# EAGLE schematic Peltier_Driver (EAGLE 7.1.0)
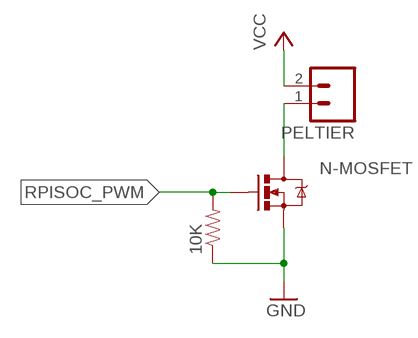
[diagram p0: schematic, sheet 1]

## Parts
10K  RESISTOR0402-RES  [0402-RES]
N-MOSFET  MOSFET-NCHANNEL2N7000  [TO-92]
PELTIER  M02-JST-2MM-SMT  [JST-2-SMD]

## Nets
GND: 10K.1 N-MOSFET.1(S)
N$1: N-MOSFET.3(D) PELTIER.1
RPISOC_PWM: 10K.2 N-MOSFET.2(G)
VCC: PELTIER.2

## Library data of the parts
10K = SparkFun-Passives:RESISTOR: Resistor Basic schematic elements and footprints for 0603, 1206, and PTH resistors.
N-MOSFET = SparkFun-DiscreteSemi:MOSFET-NCHANNEL: Common NMOSFET Parts MFG P/N Store ID Prod ID FDD8780 TRANS-09984 SI7820DN TRANS-11055 FDS6630A IC-08089 2N7002PW TRANS-11151 FQP30N06L COM-10213 TRANS-10060 BSS123LT1G TRANS-08345 BSS138 TRANS-00830 BS170 2N7000
PELTIER = SparkFun-Connectors:M02: Standard 2-pin 0.1" header. Use with - straight break away headers ( PRT-00116) - right angle break away headers (PRT-00553) - swiss pins (PRT-00743) - machine pins (PRT-00117) - female headers (PRT-00115) Molex polarized connector foot print use with: PRT-08233 with associated crimp pins and housings. 2.54_SCREWTERM for use with PRT-10571. 3.5mm Screw Terminal footprints for PRT-08084 5mm Screw Terminal footprints for use with PRT-08432; PROD_ID: CONN-08352